# Altium project STC12C5A60S2-35I-LQFP48_led流水灯_Project.PrjPcb
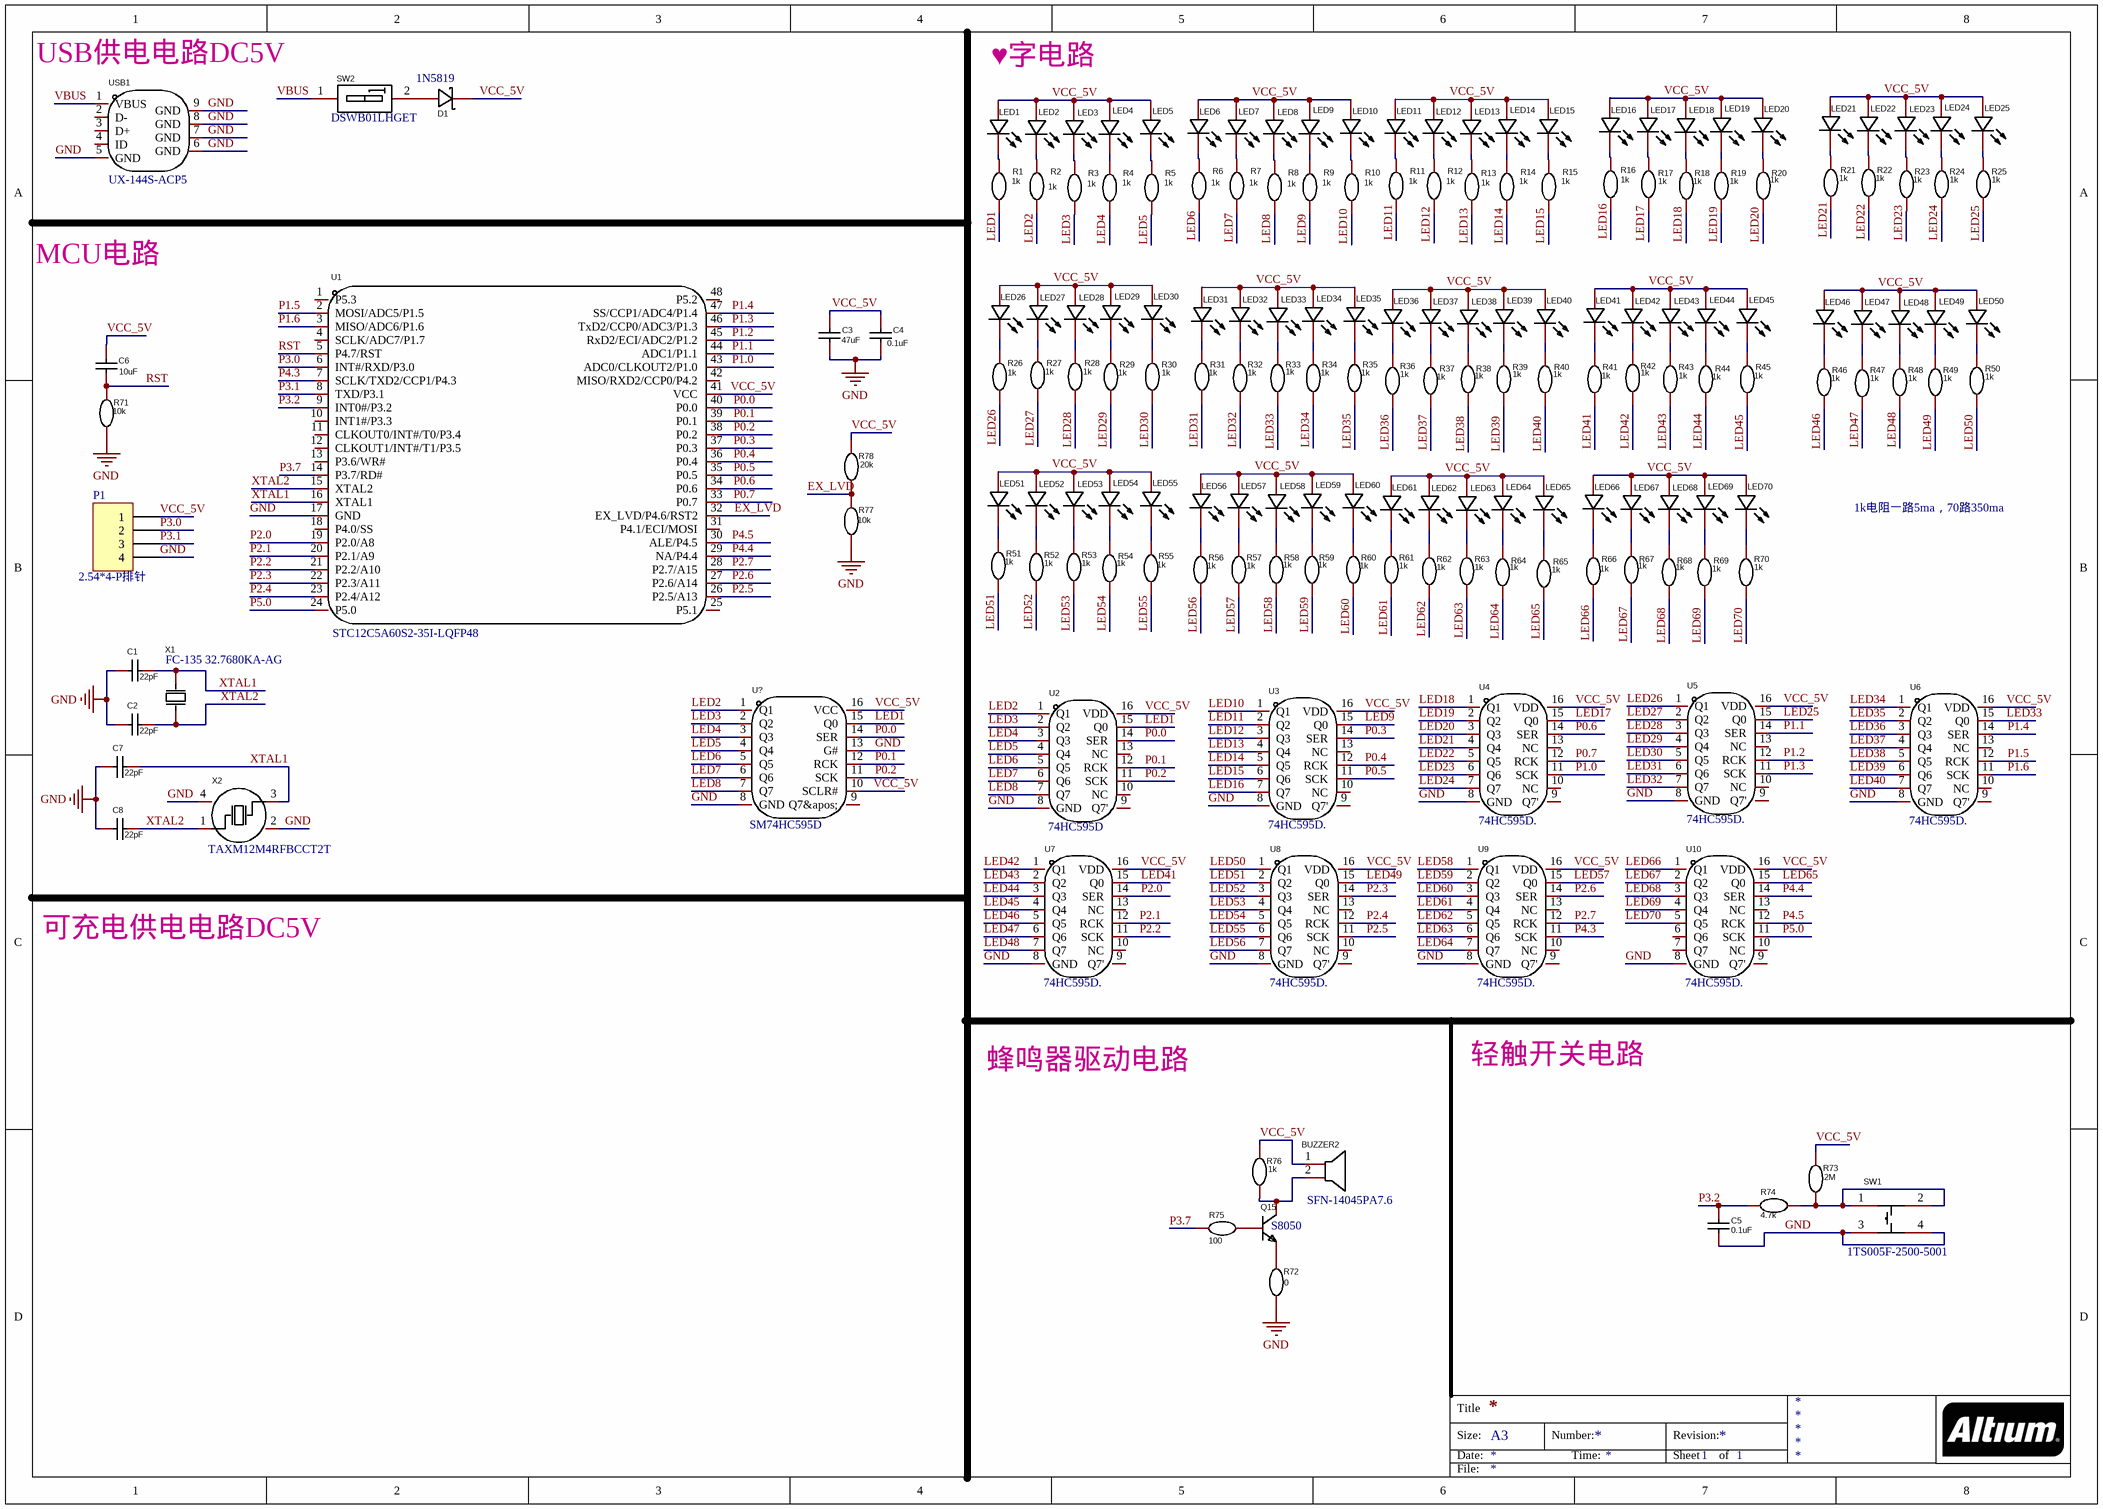
[diagram p0: STC12C5A60S2-35I-LQFP48_led流水灯_Project.SchDoc]
1 sheet, 176 parts. Net scope: global (net labels, ports and power ports of the same name join across sheets).
Board file: STC12C5A60S2-35I-LQFP48_led流水灯_Project.PcbDoc

## Sheet STC12C5A60S2-35I-LQFP48_led流水灯_Project.SchDoc
size A3; SheetNumber: 1; SheetTotal: 1; PageSetup: Record=PageOptions|CenterHorizontal=True|CenterVertical=True|PrintScale=0.73|XCorrection=1.00|YCorrection=1.00|PrintKind=0|BorderSize=5000000|LeftOffset=0|BottomOffset=0|Orientation=2|PaperLength=1000|PaperWidth=1000|Scale=100|PaperSource=7|PrintQuality=-3|MediaType=1|DitherType=10|PaperKind=A4|PrintScaleMode=1

### Parts
BUZZER2  SFN-14045PA7.6  [插件,D=14mm]
C1  value 22pF  [C0805]
C2  value 22pF  [C0805]
C3  value 47uF  [C0805]
C4  value 0.1uF  [C0805]
C5  value 0.1uF  [C0805]
C6  value 10uF  [C0805]
C7  value 22pF  [C0805]
C8  value 22pF  [C0805]
D1  1N5819  [SMA_L4.4-W2.6-LS5.0-RD]
LED1  TLMG1100-GS08  [LED0603]  (value not drawn)
LED2  TLMG1100-GS08  [LED0603]  (value not drawn)
LED3  TLMG1100-GS08  [LED0603]  (value not drawn)
LED4  TLMG1100-GS08  [LED0603]  (value not drawn)
LED5  TLMG1100-GS08  [LED0603]  (value not drawn)
LED6  TLMG1100-GS08  [LED0603]  (value not drawn)
LED7  TLMG1100-GS08  [LED0603]  (value not drawn)
LED8  TLMG1100-GS08  [LED0603]  (value not drawn)
LED9  TLMG1100-GS08  [LED0603]  (value not drawn)
LED10  TLMG1100-GS08  [LED0603]  (value not drawn)
LED11  TLMG1100-GS08  [LED0603]  (value not drawn)
LED12  TLMG1100-GS08  [LED0603]  (value not drawn)
LED13  TLMG1100-GS08  [LED0603]  (value not drawn)
LED14  TLMG1100-GS08  [LED0603]  (value not drawn)
LED15  TLMG1100-GS08  [LED0603]  (value not drawn)
LED16  TLMG1100-GS08  [LED0603]  (value not drawn)
LED17  TLMG1100-GS08  [LED0603]  (value not drawn)
LED18  TLMG1100-GS08  [LED0603]  (value not drawn)
LED19  TLMG1100-GS08  [LED0603]  (value not drawn)
LED20  TLMG1100-GS08  [LED0603]  (value not drawn)
LED21  TLMG1100-GS08  [LED0603]  (value not drawn)
LED22  TLMG1100-GS08  [LED0603]  (value not drawn)
LED23  TLMG1100-GS08  [LED0603]  (value not drawn)
LED24  TLMG1100-GS08  [LED0603]  (value not drawn)
LED25  TLMG1100-GS08  [LED0603]  (value not drawn)
LED26  TLMG1100-GS08  [LED0603]  (value not drawn)
LED27  TLMG1100-GS08  [LED0603]  (value not drawn)
LED28  TLMG1100-GS08  [LED0603]  (value not drawn)
LED29  TLMG1100-GS08  [LED0603]  (value not drawn)
LED30  TLMG1100-GS08  [LED0603]  (value not drawn)
LED31  TLMG1100-GS08  [LED0603]  (value not drawn)
LED32  TLMG1100-GS08  [LED0603]  (value not drawn)
LED33  TLMG1100-GS08  [LED0603]  (value not drawn)
LED34  TLMG1100-GS08  [LED0603]  (value not drawn)
LED35  TLMG1100-GS08  [LED0603]  (value not drawn)
LED36  TLMG1100-GS08  [LED0603]  (value not drawn)
LED37  TLMG1100-GS08  [LED0603]  (value not drawn)
LED38  TLMG1100-GS08  [LED0603]  (value not drawn)
LED39  TLMG1100-GS08  [LED0603]  (value not drawn)
LED40  TLMG1100-GS08  [LED0603]  (value not drawn)
LED41  TLMG1100-GS08  [LED0603]  (value not drawn)
LED42  TLMG1100-GS08  [LED0603]  (value not drawn)
LED43  TLMG1100-GS08  [LED0603]  (value not drawn)
LED44  TLMG1100-GS08  [LED0603]  (value not drawn)
LED45  TLMG1100-GS08  [LED0603]  (value not drawn)
LED46  TLMG1100-GS08  [LED0603]  (value not drawn)
LED47  TLMG1100-GS08  [LED0603]  (value not drawn)
LED48  TLMG1100-GS08  [LED0603]  (value not drawn)
LED49  TLMG1100-GS08  [LED0603]  (value not drawn)
LED50  TLMG1100-GS08  [LED0603]  (value not drawn)
LED51  TLMG1100-GS08  [LED0603]  (value not drawn)
LED52  TLMG1100-GS08  [LED0603]  (value not drawn)
LED53  TLMG1100-GS08  [LED0603]  (value not drawn)
LED54  TLMG1100-GS08  [LED0603]  (value not drawn)
LED55  TLMG1100-GS08  [LED0603]  (value not drawn)
LED56  TLMG1100-GS08  [LED0603]  (value not drawn)
LED57  TLMG1100-GS08  [LED0603]  (value not drawn)
LED58  TLMG1100-GS08  [LED0603]  (value not drawn)
LED59  TLMG1100-GS08  [LED0603]  (value not drawn)
LED60  TLMG1100-GS08  [LED0603]  (value not drawn)
LED61  TLMG1100-GS08  [LED0603]  (value not drawn)
LED62  TLMG1100-GS08  [LED0603]  (value not drawn)
LED63  TLMG1100-GS08  [LED0603]  (value not drawn)
LED64  TLMG1100-GS08  [LED0603]  (value not drawn)
LED65  TLMG1100-GS08  [LED0603]  (value not drawn)
LED66  TLMG1100-GS08  [LED0603]  (value not drawn)
LED67  TLMG1100-GS08  [LED0603]  (value not drawn)
LED68  TLMG1100-GS08  [LED0603]  (value not drawn)
LED69  TLMG1100-GS08  [LED0603]  (value not drawn)
LED70  TLMG1100-GS08  [LED0603]  (value not drawn)
P1  2.54*4-P排针  [HDR1X4]
Q15  S8050  [SOT-23]
R1  value 1k  [R0603]
R2  value 1k  [R0603]
R3  value 1k  [R0603]
R4  value 1k  [R0603]
R5  value 1k  [R0603]
R6  value 1k  [R0603]
R7  value 1k  [R0603]
R8  value 1k  [R0603]
R9  value 1k  [R0603]
R10  value 1k  [R0603]
R11  value 1k  [R0603]
R12  value 1k  [R0603]
R13  value 1k  [R0603]
R14  value 1k  [R0603]
R15  value 1k  [R0603]
R16  value 1k  [R0603]
R17  value 1k  [R0603]
R18  value 1k  [R0603]
R19  value 1k  [R0603]
R20  value 1k  [R0603]
R21  value 1k  [R0603]
R22  value 1k  [R0603]
R23  value 1k  [R0603]
R24  value 1k  [R0603]
R25  value 1k  [R0603]
R26  value 1k  [R0603]
R27  value 1k  [R0603]
R28  value 1k  [R0603]
R29  value 1k  [R0603]
R30  value 1k  [R0603]
R31  value 1k  [R0603]
R32  value 1k  [R0603]
R33  value 1k  [R0603]
R34  value 1k  [R0603]
R35  value 1k  [R0603]
R36  value 1k  [R0603]
R37  value 1k  [R0603]
R38  value 1k  [R0603]
R39  value 1k  [R0603]
R40  value 1k  [R0603]
R41  value 1k  [R0603]
R42  value 1k  [R0603]
R43  value 1k  [R0603]
R44  value 1k  [R0603]
R45  value 1k  [R0603]
R46  value 1k  [R0603]
R47  value 1k  [R0603]
R48  value 1k  [R0603]
R49  value 1k  [R0603]
R50  value 1k  [R0603]
R51  value 1k  [R0603]
R52  value 1k  [R0603]
R53  value 1k  [R0603]
R54  value 1k  [R0603]
R55  value 1k  [R0603]
R56  value 1k  [R0603]
R57  value 1k  [R0603]
R58  value 1k  [R0603]
R59  value 1k  [R0603]
R60  value 1k  [R0603]
R61  value 1k  [R0603]
R62  value 1k  [R0603]
R63  value 1k  [R0603]
R64  value 1k  [R0603]
R65  value 1k  [R0603]
R66  value 1k  [R0603]
R67  value 1k  [R0603]
R68  value 1k  [R0603]
R69  value 1k  [R0603]
R70  value 1k  [R0603]
R71  value 10k  [R0805]
R72  value 0  [R0805]
R73  value 2M  [R0805]
R74  value 4.7k  [R0805]
R75  value 100  [R0805]
R76  value 1k  [R0805]
R77  value 10k  [R0805]
R78  value 20k  [R0805]
SW1  1TS005F-2500-5001  [KEY-SMD_4P-L6.0-W6.0]
SW2  DSWB01LHGET  [SW-TH_DSWB01LHGET]
U1  STC12C5A60S2-35I-LQFP48  [LQFP-48_L7.0-W7.0]
U2  74HC595D  [SOP-16]
U3  74HC595D.  [SOP-16]
U4  74HC595D.  [SOP-16]
U5  74HC595D.  [SOP-16]
U6  74HC595D.  [SOP-16]
U7  74HC595D.  [SOP-16]
U8  74HC595D.  [SOP-16]
U9  74HC595D.  [SOP-16]
U10  74HC595D.  [SOP-16]
U?  SM74HC595D  [SOP-16_L10.0-W3.9-P1.27-LS6.0-BL]
USB1  UX-144S-ACP5  [MINI-USB-SMD_UX-144S-ACP5]
X1  FC-135 32.7680KA-AG  [SMD3215-2P]
X2  TAXM12M4RFBCCT2T  [SMD3225-4P]

### Nets
GND: C1.2 C2.2 C3.1 C4.1 C5.1 C7.2 C8.2 P1.4 R71.1 R72.1 R77.1 SW1.3 SW1.4 U1.17(GND) U2.8(GND) U3.8(GND) U4.8(GND) U5.8(GND) U6.8(GND) U7.8(GND) U8.8(GND) U9.8(GND) U10.8(GND) U?.8(GND) U?.13(G#) USB1.5(GND) USB1.6(GND) USB1.7(GND) USB1.8(GND) USB1.9(GND) X2.2(GND) X2.4(GND)
EX_LVD: R77.2 R78.1 U1.32(EX_LVD/P4.6/RST2)
LED1: R1.1 U2.15(Q0) U?.15(Q0)
LED2: R2.1 U2.1(Q1) U?.1(Q1)
LED3: R3.1 U2.2(Q2) U?.2(Q2)
LED4: R4.1 U2.3(Q3) U?.3(Q3)
LED5: R5.1 U2.4(Q4) U?.4(Q4)
LED6: R6.1 U2.5(Q5) U?.5(Q5)
LED7: R7.1 U2.6(Q6) U?.6(Q6)
LED8: R8.1 U2.7(Q7) U?.7(Q7)
LED9: R9.1 U3.15(Q0)
LED10: R10.1 U3.1(Q1)
LED11: R11.1 U3.2(Q2)
LED12: R12.1 U3.3(Q3)
LED13: R13.1 U3.4(Q4)
LED14: R14.1 U3.5(Q5)
LED15: R15.1 U3.6(Q6)
LED16: R16.1 U3.7(Q7)
LED17: R17.1 U4.15(Q0)
LED18: R18.1 U4.1(Q1)
LED19: R19.1 U4.2(Q2)
LED20: R20.1 U4.3(Q3)
LED21: R21.1 U4.4(Q4)
LED22: R22.1 U4.5(Q5)
LED23: R23.1 U4.6(Q6)
LED24: R24.1 U4.7(Q7)
LED25: R25.1 U5.15(Q0)
LED26: R26.1 U5.1(Q1)
LED27: R27.1 U5.2(Q2)
LED28: R28.1 U5.3(Q3)
LED29: R29.1 U5.4(Q4)
LED30: R30.1 U5.5(Q5)
LED31: R31.1 U5.6(Q6)
LED32: R32.1 U5.7(Q7)
LED33: R33.1 U6.15(Q0)
LED34: R34.1 U6.1(Q1)
LED35: R35.1 U6.2(Q2)
LED36: R36.1 U6.3(Q3)
LED37: R37.1 U6.4(Q4)
LED38: R38.1 U6.5(Q5)
LED39: R39.1 U6.6(Q6)
LED40: R40.1 U6.7(Q7)
LED41: R41.1 U7.15(Q0)
LED42: R42.1 U7.1(Q1)
LED43: R43.1 U7.2(Q2)
LED44: R44.1 U7.3(Q3)
LED45: R45.1 U7.4(Q4)
LED46: R46.1 U7.5(Q5)
LED47: R47.1 U7.6(Q6)
LED48: R48.1 U7.7(Q7)
LED49: R49.1 U8.15(Q0)
LED50: R50.1 U8.1(Q1)
LED51: R51.1 U8.2(Q2)
LED52: R52.1 U8.3(Q3)
LED53: R53.1 U8.4(Q4)
LED54: R54.1 U8.5(Q5)
LED55: R55.1 U8.6(Q6)
LED56: R56.1 U8.7(Q7)
LED57: R57.1 U9.15(Q0)
LED58: R58.1 U9.1(Q1)
LED59: R59.1 U9.2(Q2)
LED60: R60.1 U9.3(Q3)
LED61: R61.1 U9.4(Q4)
LED62: R62.1 U9.5(Q5)
LED63: R63.1 U9.6(Q6)
LED64: R64.1 U9.7(Q7)
LED65: R65.1 U10.15(Q0)
LED66: R66.1 U10.1(Q1)
LED67: R67.1 U10.2(Q2)
LED68: R68.1 U10.3(Q3)
LED69: R69.1 U10.4(Q4)
LED70: R70.1 U10.5(Q5)
P0.0: U1.40(P0.0) U2.14(SER) U?.14(SER)
P0.1: U1.39(P0.1) U2.12(RCK) U?.12(RCK)
P0.2: U1.38(P0.2) U2.11(SCK) U?.11(SCK)
P0.3: U1.37(P0.3) U3.14(SER)
P0.4: U1.36(P0.4) U3.12(RCK)
P0.5: U1.35(P0.5) U3.11(SCK)
P0.6: U1.34(P0.6) U4.14(SER)
P0.7: U1.33(P0.7) U4.12(RCK)
P1.0: U1.43(ADC0/CLKOUT2/P1.0) U4.11(SCK)
P1.1: U1.44(ADC1/P1.1) U5.14(SER)
P1.2: U1.45(RxD2/ECI/ADC2/P1.2) U5.12(RCK)
P1.3: U1.46(TxD2/CCP0/ADC3/P1.3) U5.11(SCK)
P1.4: U1.47(SS/CCP1/ADC4/P1.4) U6.14(SER)
P1.5: U1.2(MOSI/ADC5/P1.5) U6.12(RCK)
P1.6: U1.3(MISO/ADC6/P1.6) U6.11(SCK)
P2.0: U1.19(P2.0/A8) U7.14(SER)
P2.1: U1.20(P2.1/A9) U7.12(RCK)
P2.2: U1.21(P2.2/A10) U7.11(SCK)
P2.3: U1.22(P2.3/A11) U8.14(SER)
P2.4: U1.23(P2.4/A12) U8.12(RCK)
P2.5: U1.26(P2.5/A13) U8.11(SCK)
P2.6: U1.27(P2.6/A14) U9.14(SER)
P2.7: U1.28(P2.7/A15) U9.12(RCK)
P3.0: P1.2 U1.6(INT#/RXD/P3.0)
P3.1: P1.3 U1.8(TXD/P3.1)
P3.2: C5.2 R74.2 U1.9(INT0#/P3.2)
P3.7: R75.2 U1.14(P3.7/RD#)
P4.3: U1.7(SCLK/TXD2/CCP1/P4.3) U9.11(SCK)
P4.4: U1.29(NA/P4.4) U10.14(SER)
P4.5: U1.30(ALE/P4.5) U10.12(RCK)
P5.0: U1.24(P5.0) U10.11(SCK)
RST: C6.1 R71.2 U1.5(P4.7/RST)
VBUS: SW2.1(A1) USB1.1(VBUS)
VCC_5V: BUZZER2.1 C3.2 C4.2 C6.2 D1.1(C) LED1.1(A) LED2.1(A) LED3.1(A) LED4.1(A) LED5.1(A) LED6.1(A) LED7.1(A) LED8.1(A) LED9.1(A) LED10.1(A) LED11.1(A) LED12.1(A) LED13.1(A) LED14.1(A) LED15.1(A) LED16.1(A) LED17.1(A) LED18.1(A) LED19.1(A) LED20.1(A) LED21.1(A) LED22.1(A) LED23.1(A) LED24.1(A) LED25.1(A) LED26.1(A) LED27.1(A) LED28.1(A) LED29.1(A) LED30.1(A) LED31.1(A) LED32.1(A) LED33.1(A) LED34.1(A) LED35.1(A) LED36.1(A) LED37.1(A) LED38.1(A) LED39.1(A) LED40.1(A) LED41.1(A) LED42.1(A) LED43.1(A) LED44.1(A) LED45.1(A) LED46.1(A) LED47.1(A) LED48.1(A) LED49.1(A) LED50.1(A) LED51.1(A) LED52.1(A) LED53.1(A) LED54.1(A) LED55.1(A) LED56.1(A) LED57.1(A) LED58.1(A) LED59.1(A) LED60.1(A) LED61.1(A) LED62.1(A) LED63.1(A) LED64.1(A) LED65.1(A) LED66.1(A) LED67.1(A) LED68.1(A) LED69.1(A) LED70.1(A) P1.1 R73.2 R76.2 R78.2 U1.41(VCC) U2.16(VDD) U3.16(VDD) U4.16(VDD) U5.16(VDD) U6.16(VDD) U7.16(VDD) U8.16(VDD) U9.16(VDD) U10.16(VDD) U?.10(SCLR#) U?.16(VCC)
XTAL1: C1.1 C7.1 U1.16(XTAL1) X1.2(OSC2) X2.3(OSC2)
XTAL2: C2.1 C8.1 U1.15(XTAL2) X1.1(OSC1) X2.1(OSC1)
NetBUZZER2_2: BUZZER2.2 Q15.3 R76.1
NetD1_2: D1.2(A) SW2.2
NetLED1_2: LED1.2(K) R1.2
NetLED2_2: LED2.2(K) R2.2
NetLED3_2: LED3.2(K) R3.2
NetLED4_2: LED4.2(K) R4.2
NetLED5_2: LED5.2(K) R5.2
NetLED6_2: LED6.2(K) R6.2
NetLED7_2: LED7.2(K) R7.2
NetLED8_2: LED8.2(K) R8.2
NetLED9_2: LED9.2(K) R9.2
NetLED10_2: LED10.2(K) R10.2
NetLED11_2: LED11.2(K) R11.2
NetLED12_2: LED12.2(K) R12.2
NetLED13_2: LED13.2(K) R13.2
NetLED14_2: LED14.2(K) R14.2
NetLED15_2: LED15.2(K) R15.2
NetLED16_2: LED16.2(K) R16.2
NetLED17_2: LED17.2(K) R17.2
NetLED18_2: LED18.2(K) R18.2
NetLED19_2: LED19.2(K) R19.2
NetLED20_2: LED20.2(K) R20.2
NetLED21_2: LED21.2(K) R21.2
NetLED22_2: LED22.2(K) R22.2
NetLED23_2: LED23.2(K) R23.2
NetLED24_2: LED24.2(K) R24.2
NetLED25_2: LED25.2(K) R25.2
NetLED26_2: LED26.2(K) R26.2
NetLED27_2: LED27.2(K) R27.2
NetLED28_2: LED28.2(K) R28.2
NetLED29_2: LED29.2(K) R29.2
NetLED30_2: LED30.2(K) R30.2
NetLED31_2: LED31.2(K) R31.2
NetLED32_2: LED32.2(K) R32.2
NetLED33_2: LED33.2(K) R33.2
NetLED34_2: LED34.2(K) R34.2
NetLED35_2: LED35.2(K) R35.2
NetLED36_2: LED36.2(K) R36.2
NetLED37_2: LED37.2(K) R37.2
NetLED38_2: LED38.2(K) R38.2
NetLED39_2: LED39.2(K) R39.2
NetLED40_2: LED40.2(K) R40.2
NetLED41_2: LED41.2(K) R41.2
NetLED42_2: LED42.2(K) R42.2
NetLED43_2: LED43.2(K) R43.2
NetLED44_2: LED44.2(K) R44.2
NetLED45_2: LED45.2(K) R45.2
NetLED46_2: LED46.2(K) R46.2
NetLED47_2: LED47.2(K) R47.2
NetLED48_2: LED48.2(K) R48.2
NetLED49_2: LED49.2(K) R49.2
NetLED50_2: LED50.2(K) R50.2
NetLED51_2: LED51.2(K) R51.2
NetLED52_2: LED52.2(K) R52.2
NetLED53_2: LED53.2(K) R53.2
NetLED54_2: LED54.2(K) R54.2
NetLED55_2: LED55.2(K) R55.2
NetLED56_2: LED56.2(K) R56.2
NetLED57_2: LED57.2(K) R57.2
NetLED58_2: LED58.2(K) R58.2
NetLED59_2: LED59.2(K) R59.2
NetLED60_2: LED60.2(K) R60.2
NetLED61_2: LED61.2(K) R61.2
NetLED62_2: LED62.2(K) R62.2
NetLED63_2: LED63.2(K) R63.2
NetLED64_2: LED64.2(K) R64.2
NetLED65_2: LED65.2(K) R65.2
NetLED66_2: LED66.2(K) R66.2
NetLED67_2: LED67.2(K) R67.2
NetLED68_2: LED68.2(K) R68.2
NetLED69_2: LED69.2(K) R69.2
NetLED70_2: LED70.2(K) R70.2
NetQ15_1: Q15.1 R75.1
NetQ15_2: Q15.2 R72.2
NetR73_1: R73.1 R74.1 SW1.1 SW1.2

Not connected (* = marked no-connect by the designer): U1 1(P5.3) 4(SCLK/ADC7/P1.7) 10(INT1#/P3.3) 11(CLKOUT0/INT#/T0/P3.4) 12(CLKOUT1/INT#/T1/P3.5) 13(P3.6/WR#) 18(P4.0/SS) 25(P5.1) 31(P4.1/ECI/MOSI) 42(MISO/RXD2/CCP0/P4.2) 48(P5.2); U2 9(Q7') 10(NC) 13(NC); U3 9(Q7') 10(NC) 13(NC); U4 9(Q7') 10(NC) 13(NC); U5 9(Q7') 10(NC) 13(NC); U6 9(Q7') 10(NC) 13(NC); U7 9(Q7') 10(NC) 13(NC); U8 9(Q7') 10(NC) 13(NC); U9 9(Q7') 10(NC) 13(NC); U10 6(Q6) 7(Q7) 9(Q7') 10(NC) 13(NC); U? 9(Q7&apos;); USB1 2(D-) 3(D+) 4(ID)

### Notes on the sheet
- (near USB1) USB供电电路DC5V
- ♥字电路
- MCU电路
- 1k电阻一路5ma，70路350ma
- 可充电供电电路DC5V
- 蜂鸣器驱动电路
- 轻触开关电路
- Title
- Size:
- Date:
- A3
- Number:
- Time:
- Revision:
- Sheet
- of
- File:

### Library data of the parts
BUZZER2 = GPC12075YB-5V: 品牌：S&S(海旭); Manufacturer: INGHAi(赢海); Name: 4000Hz; Add into BOM: yes; Oscillator Circuit: 无源(外部驱动); Technology Type: 压电式; Rated Voltage: 5V; Value: 4000Hz; Sound Pressure Level (SPL): 80dB@12V,10cm; Symbol: GPC12075YB-5V; Device: GPC12075YB-5V; LCSC Part Name: GPC12075YB-5V; Supplier Part: C252948; Manufacturer Part: GPC12075YB-5V; Supplier Footprint: -; JLCPCB Part Class: Extended Part; Datasheet: https://atta.szlcsc.com/upload/public/pdf/source/20180829/C252948_AFFEFE4B0E08148D92156D1A8E3E594F.pdf; Supplier: LCSC; Convert to PCB: yes; Diameter (φD): 12mm; Height: 7.7mm
C1-C8 = C?: Manufacturer: muRata(村田); Symbol: GRM21BR60J107ME15L; Add into BOM: yes; Tolerance: ±20%; Voltage Rated: 6.3V; Temperature Coefficient: X5R; Device: GRM21BR60J107ME15L; LCSC Part Name: 100uF ±20% 6.3V; Supplier Part: C141660; Manufacturer Part: GRM21BR60J107ME15L; Supplier Footprint: 0805; JLCPCB Part Class: Extended Part; Datasheet: https://atta.szlcsc.com/upload/public/pdf/source/20171113/C141660_15105613320671115822.pdf; Supplier: LCSC; Convert to PCB: yes
  C1 C2 C7 C8: Name: 22pF
  C3: Name: 47uF
  C4 C5: Name: 0.1uF
  C6: Name: 10uF
D1 = 1N5819_C437199: 品牌：KEXIN(科信); Add into BOM: yes; Reverse Voltage (Vr): 40V; Average Rectified Current (Io): 1A; Forward Voltage (Vf@If): 500mV@1A; Name: 1N5819; Symbol: 1N5819_C437199; Device: 1N5819_C437199; LCSC Part Name: 40V 1A 500mV@1A; Supplier Part: C437199; Manufacturer: KEXIN(科信); Manufacturer Part: 1N5819; Supplier Footprint: SMA; JLCPCB Part Class: Extended Part; Datasheet: https://atta.szlcsc.com/upload/public/pdf/source/20191012/C437199_83583E622A6684E767605E43C169C596.pdf; Supplier: LCSC; Convert to PCB: yes
LED1-LED70 = TLMG1100-GS08: LED?; Manufacturer: VISHAY(威世); Add into BOM: yes; Illumination Color: 普绿/黄绿; Luminous Intensity (IF=20mA): 35mcd; Dominant Wavelength / Coordinate rank: 570nm; Name: TLMG1100-GS08; Symbol: TLMG1100-GS08; Device: TLMG1100-GS08; LCSC Part Name: 普绿/黄绿 0603; Supplier Part: C241891; Manufacturer Part: TLMG1100-GS08; Supplier Footprint: 0603; JLCPCB Part Class: Extended Part; Datasheet: https://atta.szlcsc.com/upload/public/pdf/source/20180719/C241891_3C76D4DD30CDE57601F75DEAAAECA69D.pdf; Supplier: LCSC; Convert to PCB: yes; Mounting Type: 表面贴装; Correlated Color Temperature - CCT(K): -; Luminous Flux/Radiant Flux: -
P1 = Header 4: 生产不焊接; LatestRevisionDate: 17-Jul-2002; LatestRevisionNote: Re-released for DXP Platform.; Publisher: Altium Limited; Value: *
Q15 = S8050: 品牌：CJ(江苏长电/长晶); Manufacturer: Hottech(合科泰); Symbol: S8050_C181158; Add into BOM: yes; Transistor Type: NPN; Collector-Emitter Breakdown Voltage (Vceo): 25V; Collector Current (Ic): 500mA; Power Dissipation (Pd): 300mW; Collector Cut-Off Current (Icbo): 100nA; Collector-Emitter Saturation Voltage (VCE(sat)@Ic,Ib): 600mV@500mA,50mA; Transition Frequency (fT): 150MHz; Name: S8050; Device: S8050_C181158; LCSC Part Name: NPN 25V 500mA; Supplier Part: C181158; Manufacturer Part: S8050; Supplier Footprint: SOT-23; JLCPCB Part Class: Extended Part; Datasheet: https://atta.szlcsc.com/upload/public/pdf/source/20220506/D987F39D56F2975D34EC7947E75C4ABC.pdf; Supplier: LCSC; Convert to PCB: yes; Operating Temperature: +150℃@(Tj)
R1-R76 = ERJPB6B1001V: Manufacturer: PANASONIC(松下); Add into BOM: yes; Symbol: ERJPB6B1001V; Device: ERJPB6B1001V; LCSC Part Name: 1KΩ(1001) ±0.1%; Supplier Part: C413712; Manufacturer Part: ERJPB6B1001V; Supplier Footprint: 0805; JLCPCB Part Class: Extended Part; Datasheet: https://atta.szlcsc.com/upload/public/pdf/source/20190821/C413712_16C6B59B4DECA51D4907C6F5D5BAEAA8.pdf; Supplier: LCSC; Convert to PCB: yes
R77 R78 = ERJPB6B1001V: R; Manufacturer: PANASONIC(松下); Add into BOM: yes; Symbol: ERJPB6B1001V; Device: ERJPB6B1001V; LCSC Part Name: 1KΩ(1001) ±0.1%; Supplier Part: C413712; Manufacturer Part: ERJPB6B1001V; Supplier Footprint: 0805; JLCPCB Part Class: Extended Part; Datasheet: https://atta.szlcsc.com/upload/public/pdf/source/20190821/C413712_16C6B59B4DECA51D4907C6F5D5BAEAA8.pdf; Supplier: LCSC; Convert to PCB: yes
SW1 = 1TS005F-2500-5001: 品牌： HYP(鸿源精密); Add into BOM: yes; Contact Current: 50mA; Voltage Rating (DC): 12V; Power Rating: 0.6W; Insulation Resistance: 100MΩ; Circuit: 单刀单掷; Actuator Style: 圆形按钮; Actuator/Cap Color: 黑色; With Lamp: 无; Operating Force: 250gf@±50gf; Mechanical Life: 7万次; Pin Style: 鸥翼型; Switch Length: 6mm; Switch Height: 5mm; Strike Gundam: 否; Name: 1TS005F-2500-5001; Symbol: 1TS005F-2500-5001; Device: 1TS005F-2500-5001; LCSC Part Name: 6*6*5mm 立贴 轻触开关; Supplier Part: C255812; Manufacturer: HYP(鸿源精密); Manufacturer Part: 1TS005F-2500-5001; Supplier Footprint: SMD,6x6mm; JLCPCB Part Class: Extended Part; Datasheet: https://atta.szlcsc.com/upload/public/pdf/source/20180720/C255812_0808C7D708FD1FB7246546D29134BBAD.pdf; Supplier: LCSC; Convert to PCB: yes; Mounting Style: 立贴; Operating Temperature: -40℃~+90℃; Switch Width: 6mm
SW2 = DSWB01LHGET: Manufacturer: YE; Add into BOM: yes; Circuit: 单刀单掷; Number of Positions: 1; Name: DSWB01LHGET; Symbol: DSWB01LHGET; Device: DSWB01LHGET; LCSC Part Name: 红色宽体1位顶拨插件; Supplier Part: C126888; Manufacturer Part: DSWB01LHGET; Supplier Footprint: 插件; JLCPCB Part Class: Extended Part; Datasheet: https://atta.szlcsc.com/upload/public/pdf/source/20170824/C126888_1503565979649906649.pdf; Supplier: LCSC; Convert to PCB: yes; Type: 平拨,凸起式; Lead Pitch: -; Operating Life: -; Color: 红色
U1 = STC12C5A60S2-35I-LQFP48: Manufacturer: STC(宏晶); Add into BOM: yes; CPU Core: 51系列; CPU Maximum Speed: 35MHz; Operating Voltage Range: 4V~5.5V; Program Storage Size: 60KB; Program Memory Type: FLASH; RAM Size: 1.25KB; GPIO Ports Number: 44; ADC (Bit): 10bit; 16Bit Timer: 2; SPI: 1; Peripheral/Function: 低电压检测；看门狗；CCP捕获/比较; Watchdog: 有; Name: STC12C5A60S2-35I-LQFP48; Symbol: STC12C5A60S2-35I; Device: STC12C5A60S2-35I-LQFP48; LCSC Part Name: 51系列 35MHz; Supplier Part: C8695; Manufacturer Part: STC12C5A60S2-35I-LQFP48; Supplier Footprint: LQFP-48(7x7); JLCPCB Part Class: Extended Part; Datasheet: https://atta.szlcsc.com/upload/public/pdf/source/20120808/1457706522369.pdf; Supplier: LCSC; Convert to PCB: yes; EEPROM: -; DAC (Bit): -; PWM (Bit): -; 8Bit Timer: -; 32Bit Timer: -; CAN: -; UART/USART: 2; I2C: -; I2S: -; Universal Serial Bus: -; Internal Comparator: -; communication protocol: -; Real-Time Clock: -; Infrared Data Association: -; Low-Voltage Detect: 有; CCP Capture/Compare: 有; Secure Digital Input and Output: -; Direct Memory Access: -; Internal Oscillator: 有; Operating Temperature Range: -40℃~+85℃
U2-U10 = 74HC595D.: 品牌： JSMSEMI(杰盛微); Designer: U?; Symbol: 74HC595D.; Device: 74HC595D.
U? = SM74HC595D: Manufacturer: 明微; Add into BOM: yes; Name: SM74HC595D; Symbol: SM74HC595D; Device: SM74HC595D; LCSC Part Name: SM74HC595D; Supplier Part: C93838; Manufacturer Part: SM74HC595D; Supplier Footprint: SOP-16-150mil; JLCPCB Part Class: Extended Part; Datasheet: https://atta.szlcsc.com/upload/public/pdf/source/20170120/1484891305667.pdf; Supplier: LCSC; Convert to PCB: yes
USB1 = UX-144S-ACP5: 品牌： XUNPU(讯普); Add into BOM: yes; Connector Type: Mini-B; Gender: 母座; Number of Contacts: 5; Number of Ports: 1; Current Rating - Power (Max): 1.5A; Welding Temperature (Max): 260℃; Name: UX-144S-ACP5; Symbol: UX-144S-ACP5; Device: UX-144S-ACP5; LCSC Part Name: Mini-B 母座 卧贴; Supplier Part: C720611; Manufacturer: XUNPU(讯普); Manufacturer Part: UX-144S-ACP5; Supplier Footprint: SMD,9.20x7.50x3.85mm; JLCPCB Part Class: Extended Part; Supplier: LCSC; Convert to PCB: yes; Standard: USB 2.0; Mounting Style: 卧贴; Operating Temperature Range: -20℃~+70℃
X1 = X？: 品牌： EPSON(爱普生); Manufacturer: KDS(大真空); Symbol: DST310S 32.768KHz; Add into BOM: yes; Name: -; Device: DST310S 32.768KHz; LCSC Part Name: 32.768KHz 12.5PF 20ppm; Supplier Part: C93232; Manufacturer Part: DST310S 32.768KHz; Supplier Footprint: SMD3215-2P; JLCPCB Part Class: Extended Part; Datasheet: https://atta.szlcsc.com/upload/public/pdf/source/20170919/C93232_1505799689477977622.pdf; Supplier: LCSC; Convert to PCB: yes; Crystal Type: -; Value: -; Load Capacitance: -; Operating Temperature: -
X2 = TAXM12M4RFBCCT2T: 品牌： TAE(雅晶鑫); Name: 12MHz; Symbol: SMD-3225_4P12M12PF10PPM; Add into BOM: yes; Crystal Type: 贴片无源晶振; Value: 12MHz; Frequency Tolerance: ±10ppm; Frequency Stability: ±50ppm; Load Capacitance: 12pF; Equivalent Series Resistance (ESR): 80Ω; Device: TAXM12M4RFBCCT2T; LCSC Part Name: 12MHz ±10ppm 12pF; Supplier Part: C133337; Manufacturer: TAE(雅晶鑫); Manufacturer Part: TAXM12M4RFBCCT2T; Supplier Footprint: SMD3225-4P; JLCPCB Part Class: Extended Part; Datasheet: https://atta.szlcsc.com/upload/public/pdf/source/20171014/C133337_15079754979871038234.pdf; Supplier: LCSC; Convert to PCB: yes; Operating Temperature: -